# Altium schematic sheet Project_Information.SchDoc: =project_title
size Tabloid; CompanyName: Luxonis Holding; Organization: Luxonis Holding; Address1: 1925 Harmony Park Drive; Address2: Westminster, CO; Address3: 80234; Address4: United States; SheetNumber: 2; SheetTotal: 16
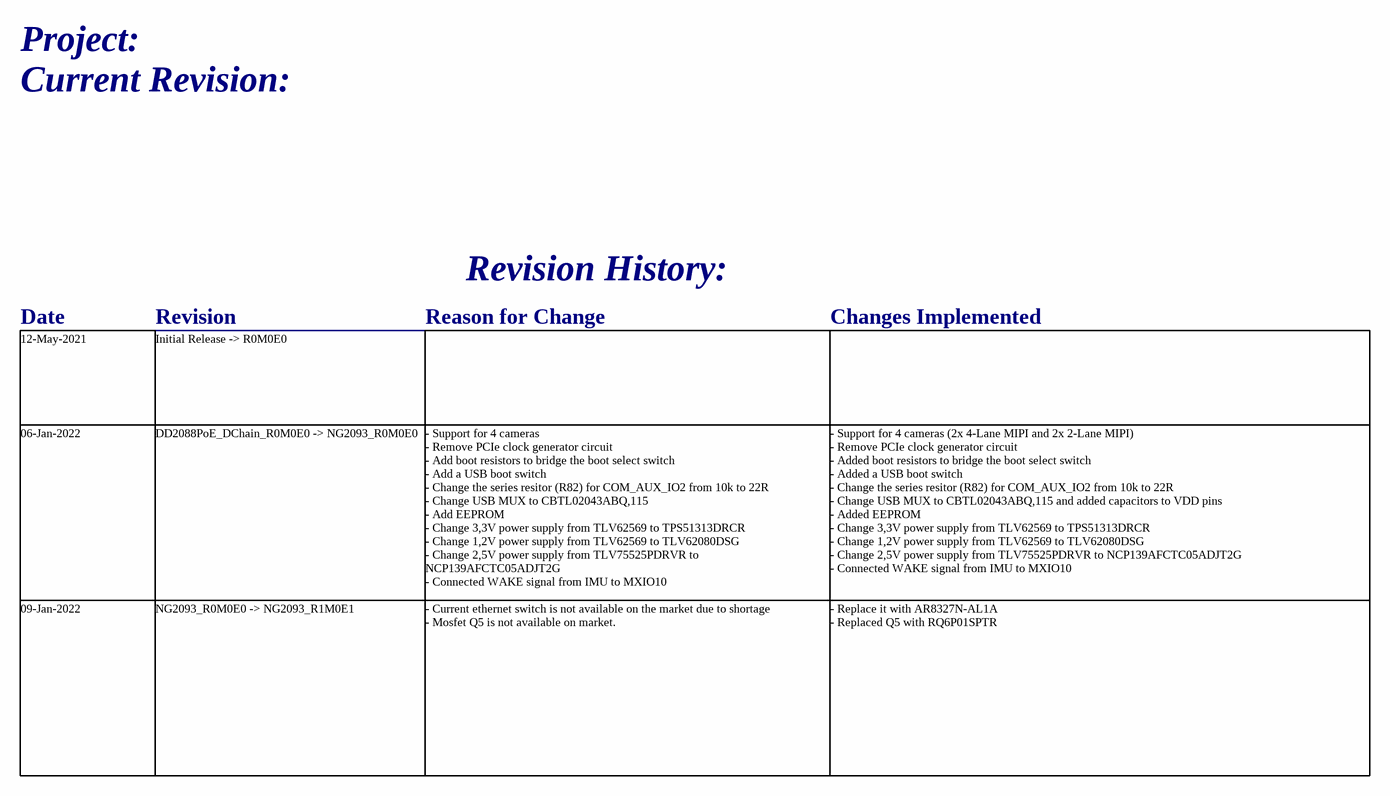
[diagram p0: Project_Information.SchDoc]

## Notes on the sheet
- Project:
- Current Revision:
- Revision History:
- Date
- Revision
- Reason for Change
- Changes Implemented
- 12-May-2021
- Initial Release -> R0M0E0
- 06-Jan-2022
- DD2088PoE_DChain_R0M0E0 -> NG2093_R0M0E0
- - Support for 4 cameras
  - Remove PCIe clock generator circuit
  - Add boot resistors to bridge the boot select switch
  - Add a USB boot switch
  - Change the series resitor (R82) for COM_AUX_IO2 from 10k to 22R
  - Change USB MUX to CBTL02043ABQ,115
  - Add EEPROM
  - Change 3,3V power supply from TLV62569 to TPS51313DRCR
  - Change 1,2V power supply from TLV62569 to TLV62080DSG
  - Change 2,5V power supply from TLV75525PDRVR to NCP139AFCTC05ADJT2G
  - Connected WAKE signal from IMU to MXIO10
- - Support for 4 cameras (2x 4-Lane MIPI and 2x 2-Lane MIPI)
  - Remove PCIe clock generator circuit
  - Added boot resistors to bridge the boot select switch
  - Added a USB boot switch
  - Change the series resitor (R82) for COM_AUX_IO2 from 10k to 22R
  - Change USB MUX to CBTL02043ABQ,115 and added capacitors to VDD pins
  - Added EEPROM
  - Change 3,3V power supply from TLV62569 to TPS51313DRCR
  - Change 1,2V power supply from TLV62569 to TLV62080DSG
  - Change 2,5V power supply from TLV75525PDRVR to NCP139AFCTC05ADJT2G
  - Connected WAKE signal from IMU to MXIO10
- 09-Jan-2022
- NG2093_R0M0E0 -> NG2093_R1M0E1
- - Current ethernet switch is not available on the market due to shortage
  - Mosfet Q5 is not available on market.
- - Replace it with AR8327N-AL1A
  - Replaced Q5 with RQ6P01SPTR
- Title
- Size:
- Date:
- Tabloid
- Number:
- Time:
- Revision:
- Sheet
- of
- Drawn by: